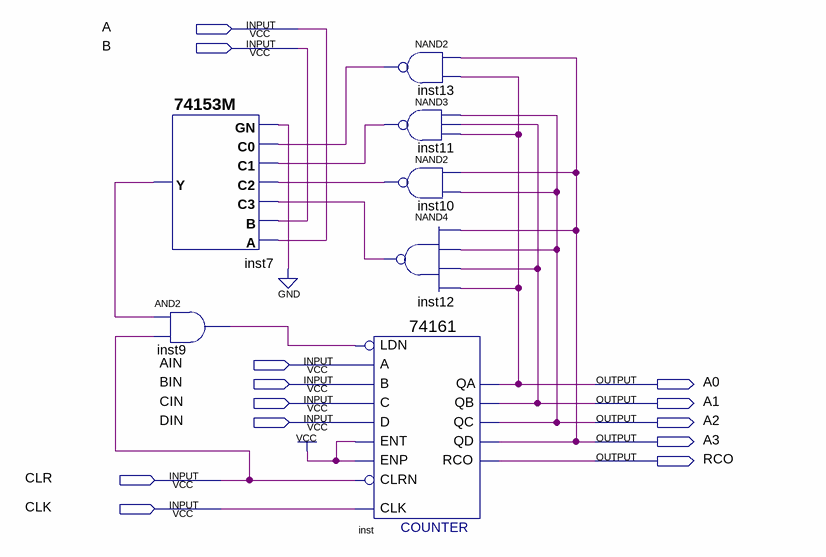
[diagram p0: schematic sheet]
// Quartus schematic Question3alt.bdf as structural Verilog: 7 symbols, 13 pins
module Question3alt (
  input  A,
  input  B,
  input  AIN,
  input  BIN,
  input  CIN,
  input  DIN,
  input  CLR,
  input  CLK,
  output A0,
  output A1,
  output A2,
  output A3,
  output RCO
);

  wire inst7_y, inst9_out, inst10_out, inst11_out, inst12_out, inst13_out;

  \74153M  inst7 (
    .A(A), .B(B), .C3(inst12_out), .C2(inst10_out), .C1(inst11_out), .C0(inst13_out), .GN(1'b0), .Y(inst7_y));
  and inst9 (inst9_out, inst7_y, CLR);
  nand inst13 (inst13_out, A3, A0);
  nand inst11 (inst11_out, A2, A1, A0);
  nand inst10 (inst10_out, A3, A2);
  nand inst12 (inst12_out, A3, A2, A1, A0);
  \74161  inst (
    .CLRN(CLR), .CLK(CLK), .ENP(1'b1), .LDN(inst9_out), .A(AIN), .D(DIN), .ENT(1'b1), .B(BIN), .C(CIN),
    .QD(A3), .QC(A2), .QB(A1), .QA(A0), .RCO(RCO));
endmodule
